# Altium schematic sheet MCU.SchDoc
size 381 x 241 mm; SheetNumber: 5; SheetTotal: 7
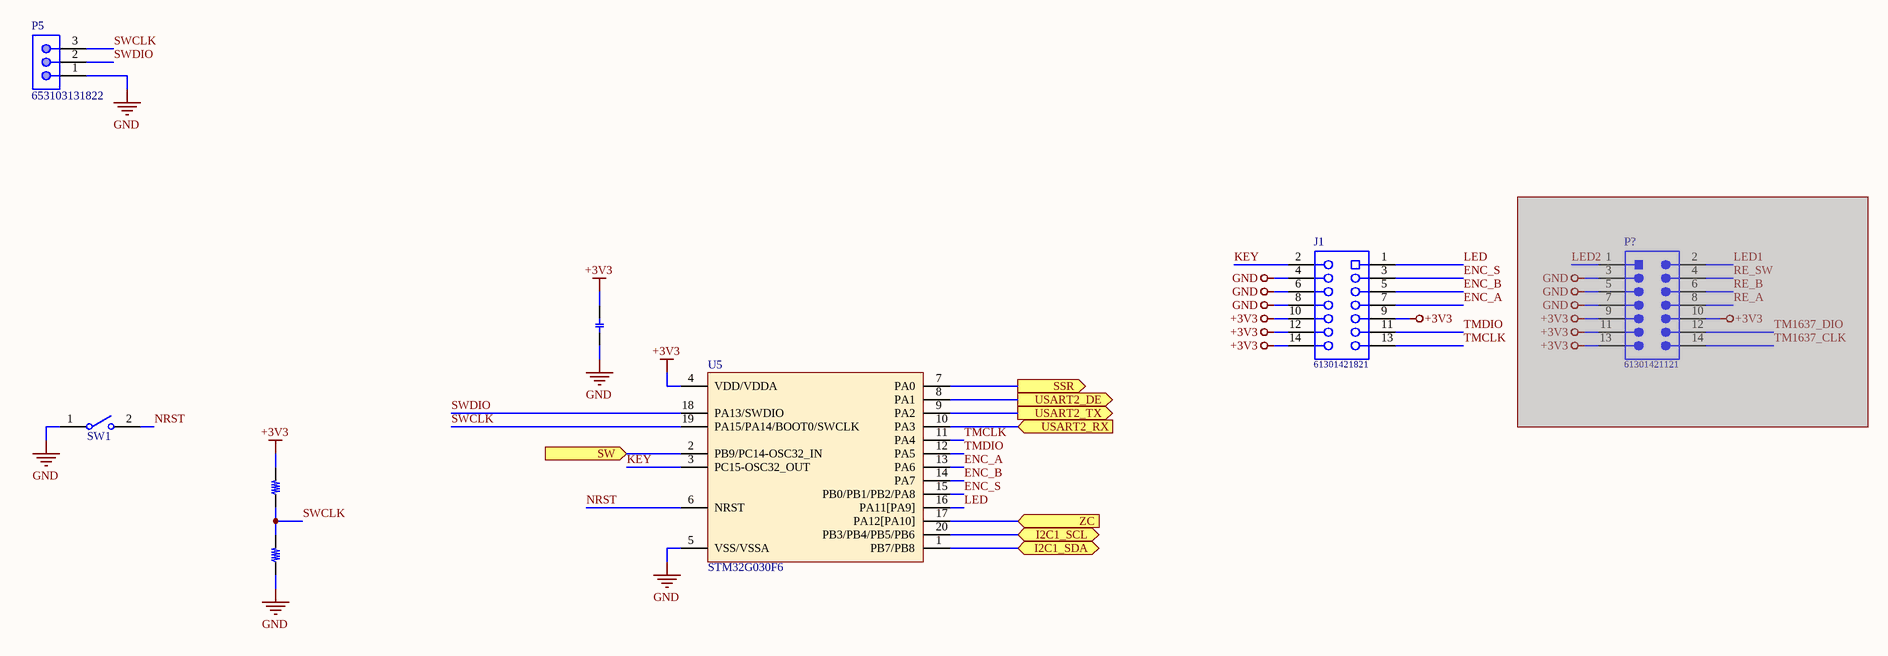
[diagram p0: MCU.SchDoc]

## Parts
C6  CAP_SMD  [C 0603]  (value not drawn)
J1  61301421821  [61301421821]
P5  653103131822  [653103131822]
P?  61301421121  [61301421121]  (masked out: inside a compile mask, not in the netlist)
R14  RES_SMD  [R 0603]  (value not drawn)
R15  RES_SMD  [R 0603]  (value not drawn)
SW1  430133050816  [WS-TASV_L6W6H5_4301330508x6]  (value not drawn)
U5  STM32G030F6  [TSSOP-20]

## Ports
I2C1_SCL (bidir), I2C1_SDA (bidir), SSR (out), SW (in), USART2_DE (out), USART2_RX (in), USART2_TX (out), ZC (in)

## Nets
+3V3: C6.2 J1.9 J1.10 J1.12 J1.14 R14.2 U5.4(VDD/VDDA)
GND: C6.1 J1.4 J1.6 J1.8 P5.1 R15.1 SW1.1 U5.5(VSS/VSSA)
ENC_A: J1.7 U5.13(PA6)
ENC_B: J1.5 U5.14(PA7)
ENC_S: J1.3 U5.15(PB0/PB1/PB2/PA8)
I2C1_SCL: U5.20(PB3/PB4/PB5/PB6) ; port I2C1_SCL
I2C1_SDA: U5.1(PB7/PB8) ; port I2C1_SDA
KEY: J1.2 U5.3(PC15-OSC32_OUT)
LED: J1.1 U5.16(PA11[PA9])
NRST: SW1.2 U5.6(NRST)
SSR: U5.7(PA0) ; port SSR
SW: U5.2(PB9/PC14-OSC32_IN) ; port SW
SWCLK: P5.3 R14.1 R15.2 U5.19(PA15/PA14/BOOT0/SWCLK)
SWDIO: P5.2 U5.18(PA13/SWDIO)
TMCLK: J1.13 U5.11(PA4)
TMDIO: J1.11 U5.12(PA5)
USART2_DE: U5.8(PA1) ; port USART2_DE
USART2_RX: U5.10(PA3) ; port USART2_RX
USART2_TX: U5.9(PA2) ; port USART2_TX
ZC: U5.17(PA12[PA10]) ; port ZC

## Library data of the parts
J1 = 61301421821: WR-PHD Socket Header, THT, pitch 2.54mm, Dual Row, Vertical, 14p; Manufacturer: Wurth Elektronik; Pin Number: 14; Rated Current: 3A; Working Voltage: 250VAC; Withstanding Voltage: 500VAC; Contact Resistance: 20mOhm; ComponentLink1Description: Manufacturer; ComponentLink1URL: http://www.we-online.de; ComponentLink2Description: Datasheet; ComponentLink2URL: https://www.we-online.com/catalog/datasheet/61301421821.pdf; Manufacturer Part Number: 61301421821; Pitch: 2.54mm; Operating Temperature: -40 to +125degC; Mounting Technology: THT; Packaging: Tray; Gender: Socket Header; Row Number: Dual; Orientation: Vertical
P5 = 653103131822: WR-WTB SMT Male Horizontal Shrouded Header, pitch 1.25mm, 3p; Pin Number: 3; Contact Resistance: 20mOhm; Rated Current: 1A; Withstanding Voltage: 250VAC; Working Voltage: 125VAC; ComponentLink1Description: Manufacturer; ComponentLink1URL: http://www.we-online.de; ComponentLink2Description: Datasheet; ComponentLink2URL: https://www.we-online.com/catalog/datasheet/653103131822.pdf; Pitch: 1.25mm; Published Date: January 2020; Publisher: Wurth Elektronik; Mounting Technology: SMT; Packaging: Tape and Reel; Operating Temperature: -40 to +85degC; Part Number: 653103131822; Gender: Male; Type: Horizontal
P? = 61301421121: WR-PHD Pin Header, THT, pitch 2.54mm, Dual Row, Vertical, 14p; Manufacturer: Wurth Elektronik; Pin Number: 14; Rated Current: 3A; Working Voltage: 250VAC; Withstanding Voltage: 500VAC; Contact Resistance: 20mOhm; ComponentLink1Description: Manufacturer; ComponentLink1URL: http://www.we-online.de; ComponentLink2Description: Datasheet; ComponentLink2URL: https://www.we-online.com/catalog/datasheet/61301421121.pdf; Manufacturer Part Number: 61301421121; Pitch: 2.54mm; Operating Temperature: -40 to +105degC; Mounting Technology: THT; Packaging: Bag; Gender: Pin Header; Row Number: Dual; Orientation: Vertical
SW1 = 430133050816: WS-TASV SMT long travel tact switch, L6 x W6 x H5mm, 160g, SPST-NO, 16V, 50mA; Manufacturer: Wurth Elektronik; Washable: No; Manufacturer Part Number: 430133050816; Category: Tact Switches; Match Code: WS-TASV; ComponentLink1Description: Website Link; ComponentLink1URL: https://www.we-online.com/redexpert/article/430133050816?ad; ComponentLink2Description: Datasheet Link; ComponentLink2URL: https://www.we-online.com/redexpert/spec/430133050816?ad; Mount: Surface Mount; Operating Temperature Max: 125°C; Operating Temperature Min: -40°C; Packaging: Tape and Reel; Length: 6mm; Width: 6mm; Height: 5mm; Circuit: SPST-NO; Contact Material: Stainless Steel; Contact Plating: Silver; Operation Force: 160g; Rated Current: 50mA; Rated Voltage (DC): 16V; Terminal Material: Copper Alloy; Terminal Plating: Silver